# EAGLE design braille keyboard (EAGLE 9.5.1)
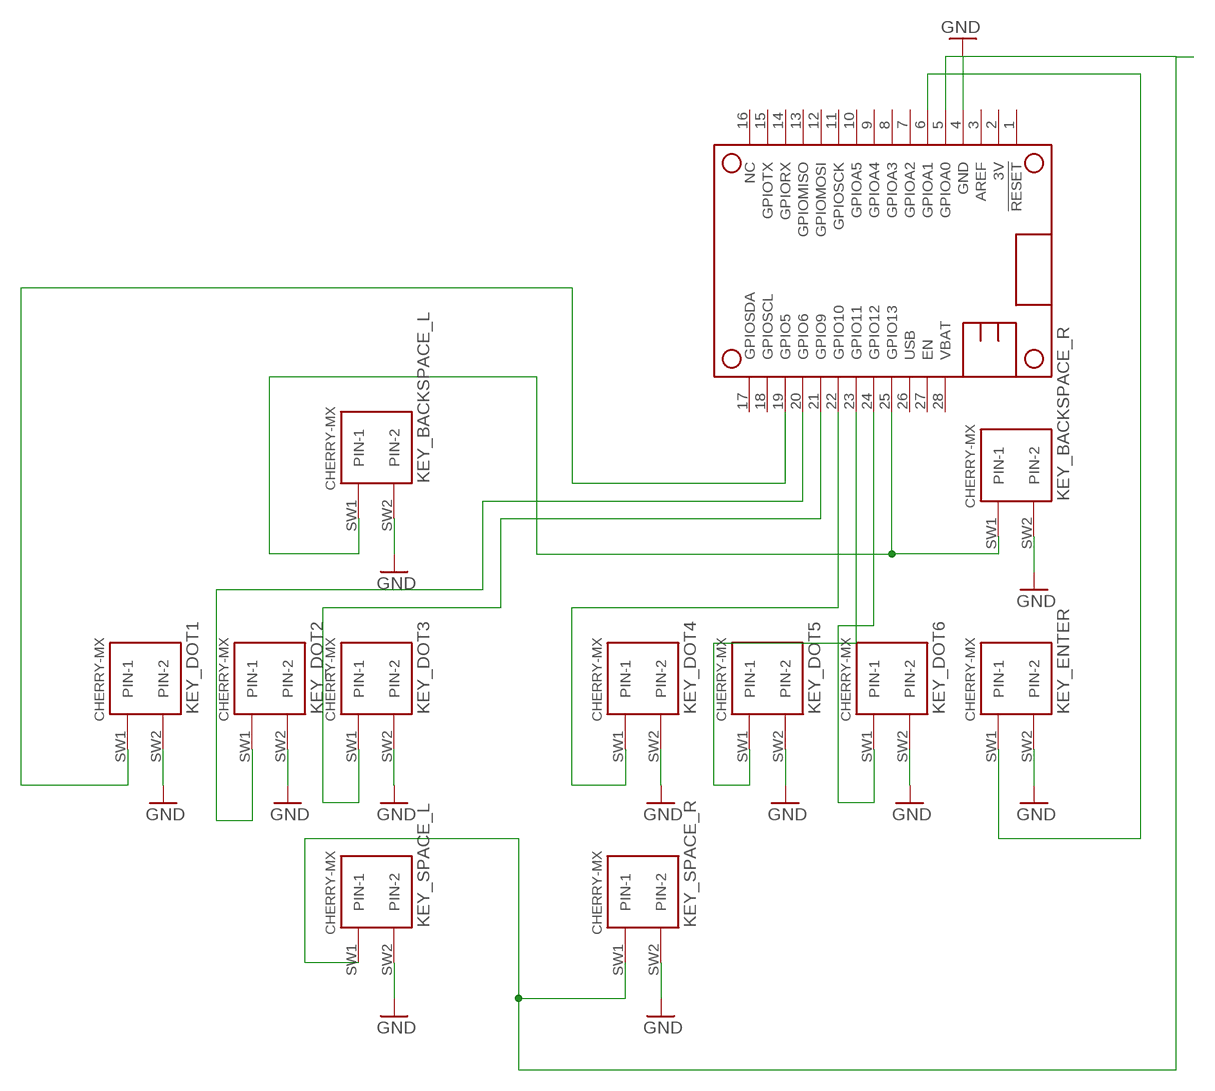
[diagram p0: schematic, sheet 1]

## Parts
KEY_BACKSPACE_L  CHERRY-MX  [CHERRY-MX]
KEY_BACKSPACE_R  CHERRY-MX  [CHERRY-MX]
KEY_DOT1  CHERRY-MX  [CHERRY-MX]
KEY_DOT2  CHERRY-MX  [CHERRY-MX]
KEY_DOT3  CHERRY-MX  [CHERRY-MX]
KEY_DOT4  CHERRY-MX  [CHERRY-MX]
KEY_DOT5  CHERRY-MX  [CHERRY-MX]
KEY_DOT6  CHERRY-MX  [CHERRY-MX]
KEY_ENTER  CHERRY-MX  [CHERRY-MX]
KEY_SPACE_L  CHERRY-MX  [CHERRY-MX]
KEY_SPACE_R  CHERRY-MX  [CHERRY-MX]
MS1  FEATHERWING  [FEATHERWING]

## Nets
GND: KEY_BACKSPACE_L.SW2(PIN-2) KEY_BACKSPACE_R.SW2(PIN-2) KEY_DOT1.SW2(PIN-2) KEY_DOT2.SW2(PIN-2) KEY_DOT3.SW2(PIN-2) KEY_DOT4.SW2(PIN-2) KEY_DOT5.SW2(PIN-2) KEY_DOT6.SW2(PIN-2) KEY_ENTER.SW2(PIN-2) KEY_SPACE_L.SW2(PIN-2) KEY_SPACE_R.SW2(PIN-2) MS1.4(GND)
N$1: KEY_DOT1.SW1(PIN-1) MS1.19(GPIO5)
N$2: KEY_DOT2.SW1(PIN-1) MS1.20(GPIO6)
N$3: KEY_DOT3.SW1(PIN-1) MS1.21(GPIO9)
N$4: KEY_SPACE_L.SW1(PIN-1) KEY_SPACE_R.SW1(PIN-1) MS1.5(GPIOA0)
N$5: KEY_DOT4.SW1(PIN-1) MS1.22(GPIO10)
N$6: KEY_DOT5.SW1(PIN-1) MS1.23(GPIO11)
N$7: KEY_DOT6.SW1(PIN-1) MS1.24(GPIO12)
N$8: KEY_BACKSPACE_L.SW1(PIN-1) KEY_BACKSPACE_R.SW1(PIN-1) MS1.25(GPIO13)
N$9: KEY_ENTER.SW1(PIN-1) MS1.6(GPIOA1)
Unconnected: MS1.1(!RESET) MS1.2(3V) MS1.3(AREF) MS1.7(GPIOA2) MS1.8(GPIOA3) MS1.9(GPIOA4) MS1.10(GPIOA5) MS1.11(GPIOSCK) MS1.12(GPIOMOSI) MS1.13(GPIOMISO) MS1.14(GPIORX) MS1.15(GPIOTX) MS1.16(NC) MS1.17(GPIOSDA) MS1.18(GPIOSCL) MS1.26(USB) MS1.27(EN) MS1.28(VBAT)

## Library data of the parts
KEY_BACKSPACE_L KEY_BACKSPACE_R KEY_DOT1-KEY_DOT6 KEY_ENTER KEY_SPACE_L KEY_SPACE_R = cherrymx:CHERRY-MX: Cherry MX series keyswitch
MS1 = adafruit:FEATHERWING

## Board
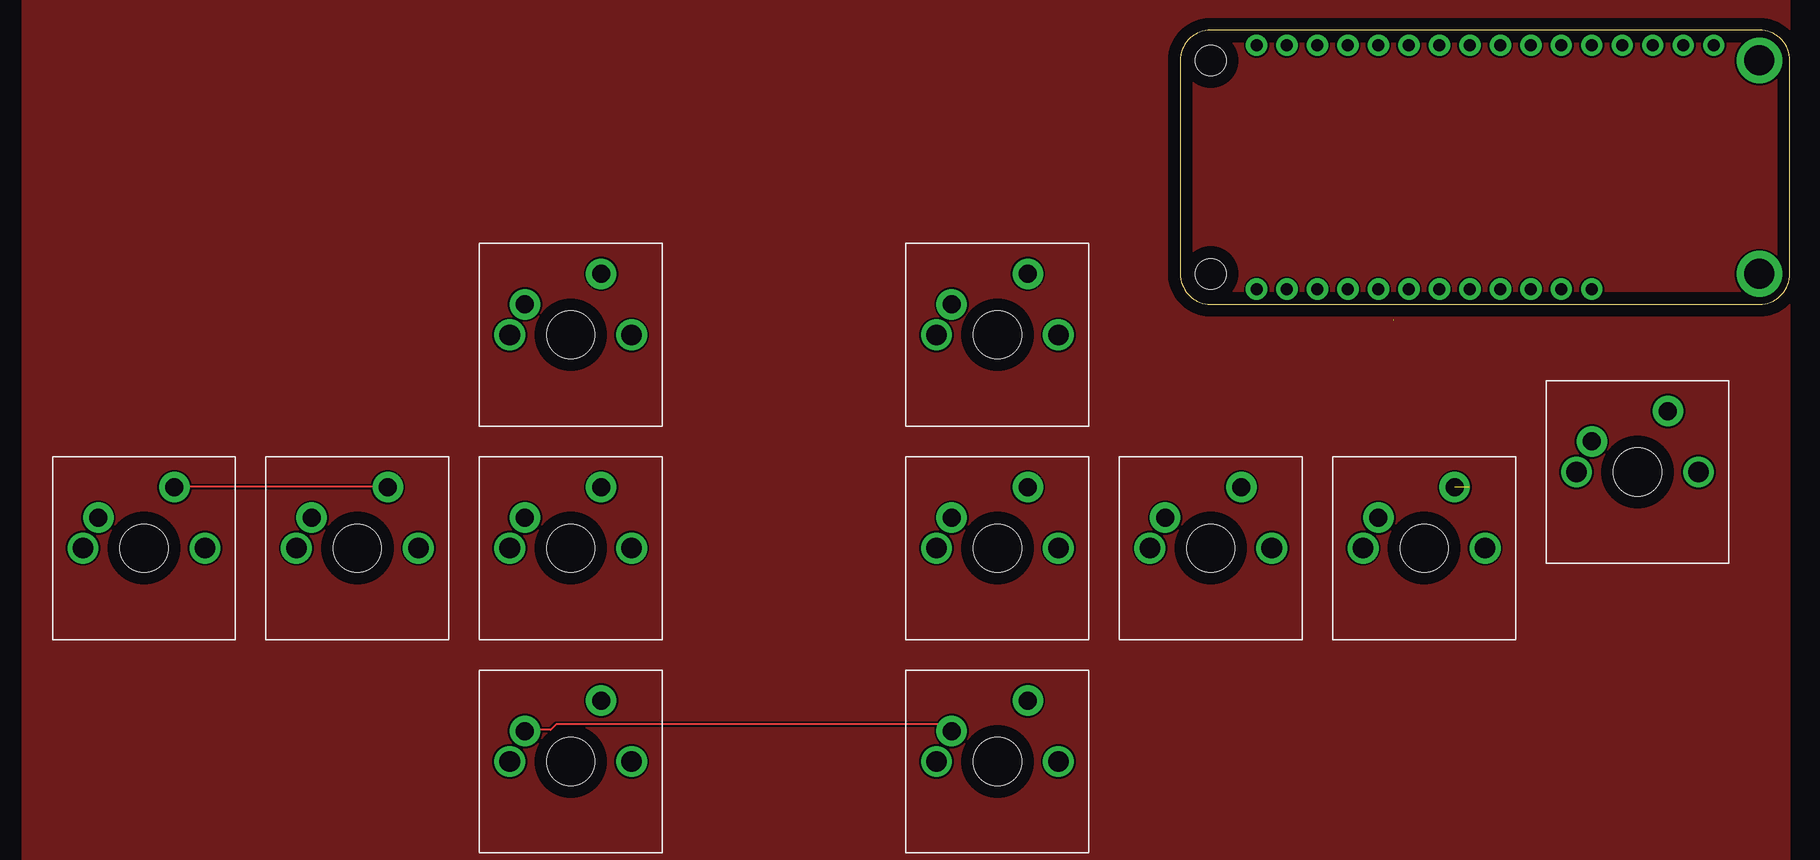
[diagram p1: board, top side]
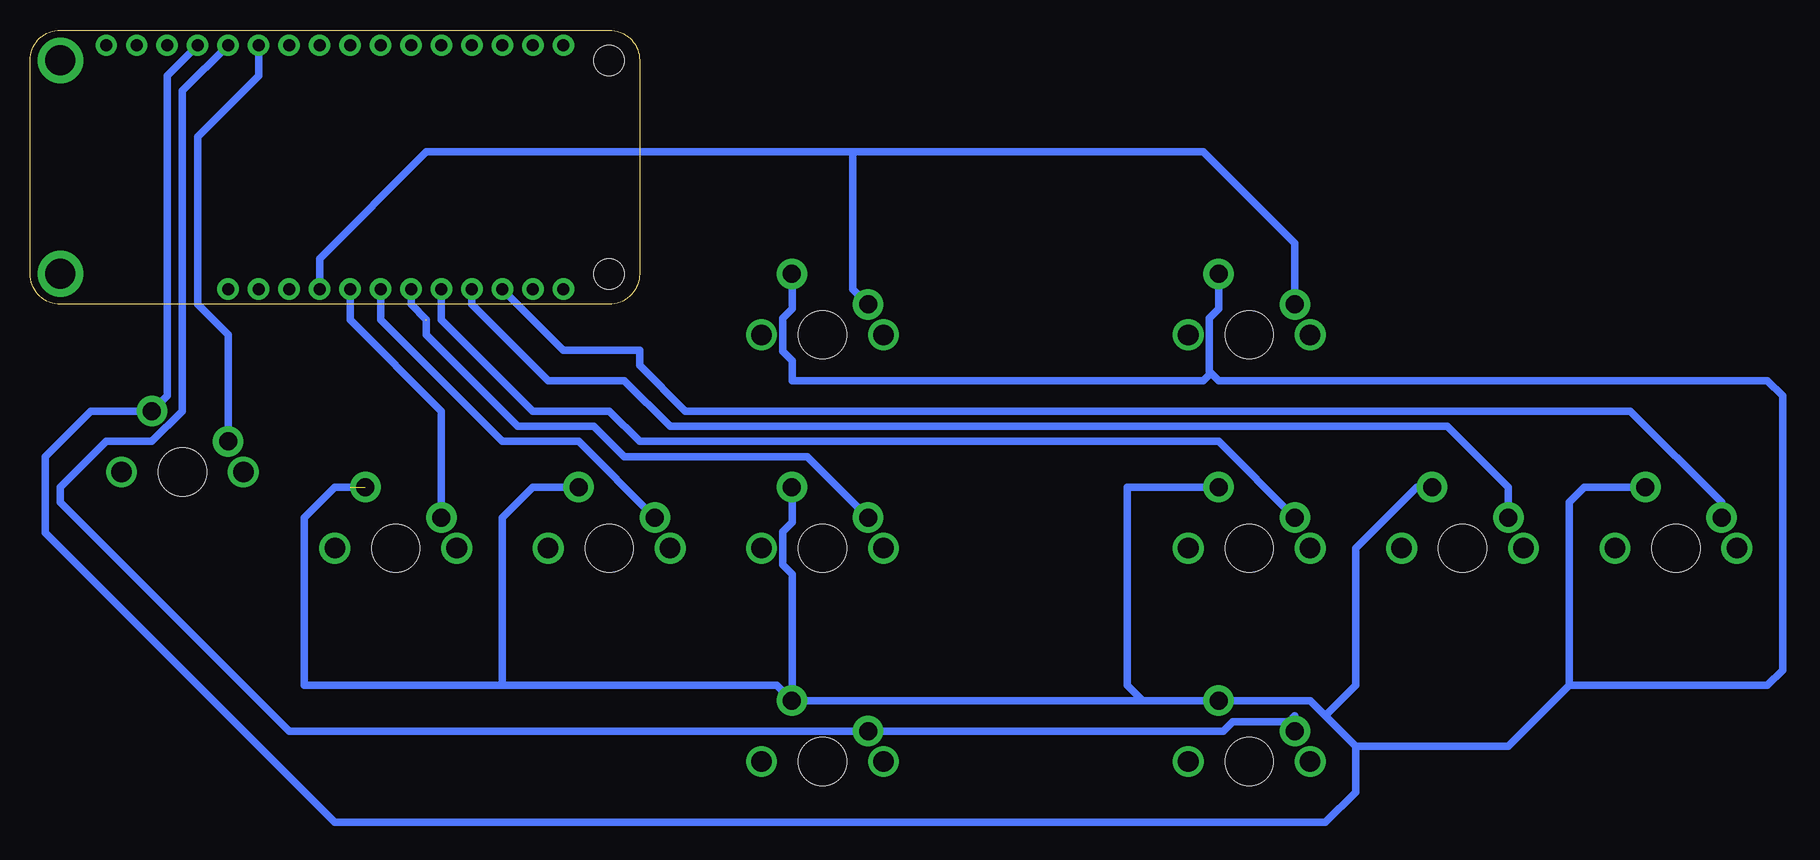
[diagram p2: board, bottom side, seen from below]

Size 50.8 x 22.86 mm. Coordinates in mm from the lower left corner, seen from the top.
Copper layers (1*16): Top 0.035mm / dielectric 1.5mm / Bottom 0.035mm
Design rules "default": minimum track width 6mil, minimum drill 0.35mm, track to track 6mil, track to pad 6mil, pad to pad 6mil, via to via 6mil, smd to smd 6mil, copper to edge 40mil, drill to drill 6mil, minimum pad ring 10mil, minimum via ring 8mil, stop-mask expansion 4mil, vias tented up to drill 0mil, thermal gap 10mil

### Footprints (pad centres in the part's own frame; a part is rotated, then mirrored left to right if it is on the bottom)
CHERRY-MX = drill 1.714 pad 1.93: P$3 -5.08,0; P$4 5.08,0 | drill 1.5 pad 2.54: SW1 -3.81,2.54; SW2 2.54,5.08 | hole 4: 0,0
FEATHERWING = drill 1 pad 1.778: 1 6.35,1.27; 2 8.89,1.27; 3 11.43,1.27; 4 13.97,1.27; 5 16.51,1.27; 6 19.05,1.27; 7 21.59,1.27; 8 24.13,1.27; 9 26.67,1.27; 10 29.21,1.27; 11 31.75,1.27; 12 34.29,1.27; 13 36.83,1.27; 14 39.37,1.27; 15 41.91,1.27; 16 44.45,1.27; 17 44.45,21.59; 18 41.91,21.59; 19 39.37,21.59; 20 36.83,21.59; 21 34.29,21.59; 22 31.75,21.59; 23 29.21,21.59; 24 26.67,21.59; 25 24.13,21.59; 26 21.59,21.59; 27 19.05,21.59; 28 16.51,21.59 | drill 2.5 pad 3.81: P$1 2.54,20.32; P$2 2.54,2.54 | hole 2.54: 48.26,20.32; 48.26,2.54

### Placement (x,y rotation side)
KEY_BACKSPACE_L  -50.8,-2.54 0 top  (outside the outline)
KEY_BACKSPACE_R  -15.24,-2.54 0 top  (outside the outline)
KEY_DOT1  -86.36,-20.32 0 top  (outside the outline)
KEY_DOT2  -68.58,-20.32 0 top  (outside the outline)
KEY_DOT3  -50.8,-20.32 0 top  (outside the outline)
KEY_DOT4  -15.24,-20.32 0 top  (outside the outline)
KEY_DOT5  2.54,-20.32 0 top  (outside the outline)
KEY_DOT6  20.32,-20.32 0 top  (outside the outline)
KEY_ENTER  38.1,-13.97 0 top  (outside the outline)
KEY_SPACE_L  -50.8,-38.1 0 top  (outside the outline)
KEY_SPACE_R  -15.24,-38.1 0 top  (outside the outline)
MS1  50.8,22.86 180 top

### Tracks (layer width: path | path; a pad name or v marks a point on that pad's centre or on a via)
BORDE
  pour Top: -96.52,-48.26 50.8,-48.26 50.8,25.4 -96.52,25.4
GND  (1 unrouted)
  Top 0.152: KEY_DOT1.SW2 -83.72,-15.19 -66.04,-15.19 KEY_DOT2.SW2
  Bottom 0.305: MS1.4 36.83,21.69
  Bottom 0.61: MS1.4 39.37,19.05 39.37,-7.62 KEY_ENTER.SW2 45.72,-8.89 49.53,-12.7 49.53,-19.05 25.4,-43.18 -57.15,-43.18 -59.69,-40.64 -59.69,-36.83 | KEY_SPACE_R.SW2 -41.91,-33.02 | -41.91,-33.02 KEY_SPACE_L.SW2 -55.88,-33.02 -57.15,-34.29 | -57.15,-34.29 -59.69,-36.83 | KEY_SPACE_R.SW2 -11.43,-31.75 11.43,-31.75 | 11.43,-31.75 27.94,-31.75 27.94,-17.78 25.4,-15.24 24.13,-15.24 | KEY_SPACE_R.SW2 -12.7,-22.48 -11.92,-21.7 -11.92,-18.94 -12.7,-18.16 KEY_DOT4.SW2 | KEY_DOT5.SW2 8.89,-15.24 11.43,-17.78 11.43,-31.75 | KEY_DOT3.SW2 -40.64,-15.24 -40.64,-31.75 -41.91,-33.02 | KEY_DOT2.SW2 -64.77,-15.24 -59.69,-20.32 -59.69,-31.75 -57.15,-34.29 | KEY_DOT1.SW2 -78.74,-15.24 -77.47,-16.51 -77.47,-31.75 | -77.47,-31.75 -72.39,-36.83 -59.69,-36.83 | KEY_BACKSPACE_L.SW2 -48.26,-0.38 -47.48,-1.16 -47.48,-5.57 | -47.48,-5.57 -47.48,-5.86 -46.99,-6.35 -12.7,-6.35 -12.7,-4.7 -11.92,-3.92 -11.92,-1.16 -12.7,-0.38 KEY_BACKSPACE_R.SW2 | -77.47,-31.75 -93.98,-31.75 -95.25,-30.48 -95.25,-7.62 -93.98,-6.35 -48.26,-6.35 -47.48,-5.57
N$1
  Bottom 0.61: KEY_DOT1.SW1 -90.17,-16.51 -82.55,-8.89 -3.81,-8.89 0,-5.08 0,-3.81 6.35,-3.81 MS1.19
N$2
  Bottom 0.61: KEY_DOT2.SW1 -72.39,-15.24 -67.31,-10.16 -2.54,-10.16 1.27,-6.35 7.62,-6.35 13.97,0 MS1.20
N$3
  Bottom 0.61: KEY_DOT3.SW1 -48.26,-11.43 0,-11.43 2.54,-8.89 8.89,-8.89 16.51,-1.27 MS1.21
N$4
  Top 0.152: KEY_SPACE_L.SW1 -54.61,-35.46 -52.48,-35.46 -52.02,-35 -19.56,-35 -19.1,-35.46 KEY_SPACE_R.SW1
  Bottom 0.61: MS1.5 38.1,17.78 38.1,-8.89 40.64,-11.43 44.45,-11.43 48.26,-15.24 48.26,-16.51 29.21,-35.56 KEY_SPACE_R.SW1 -48.64,-35.56 -49.42,-34.78 -54.12,-34.78 -54.61,-34.29
N$5  (1 unrouted)
  Bottom 0.61: 17.78,-1.27 19.05,0 MS1.22 | 17.78,-1.32 17.78,-2.54 10.16,-10.16 3.81,-10.16 1.27,-12.7 -13.97,-12.7 KEY_DOT4.SW1
N$6
  Bottom 0.61: MS1.23 21.59,-1.27 11.43,-11.43 5.08,-11.43 KEY_DOT5.SW1
N$7
  Bottom 0.61: KEY_DOT6.SW1 16.51,-8.89 24.13,-1.27 MS1.24
N$8
  Top 0.152: KEY_BACKSPACE_R.SW1 -19.71,0.66 | -54.61,0.05 KEY_BACKSPACE_L.SW1
  Bottom 0.61: KEY_BACKSPACE_L.SW1 -54.61,5.08 -46.99,12.7 -17.78,12.7 | -17.78,12.7 17.78,12.7 26.67,3.81 MS1.25 | -17.78,12.7 -17.78,1.27 KEY_BACKSPACE_R.SW1
N$9
  Bottom 0.61: KEY_ENTER.SW1 34.29,-2.54 36.83,0 36.83,13.97 31.75,19.05 MS1.6